# EAGLE design nano_hold_1_2 (EAGLE 7.5.0)
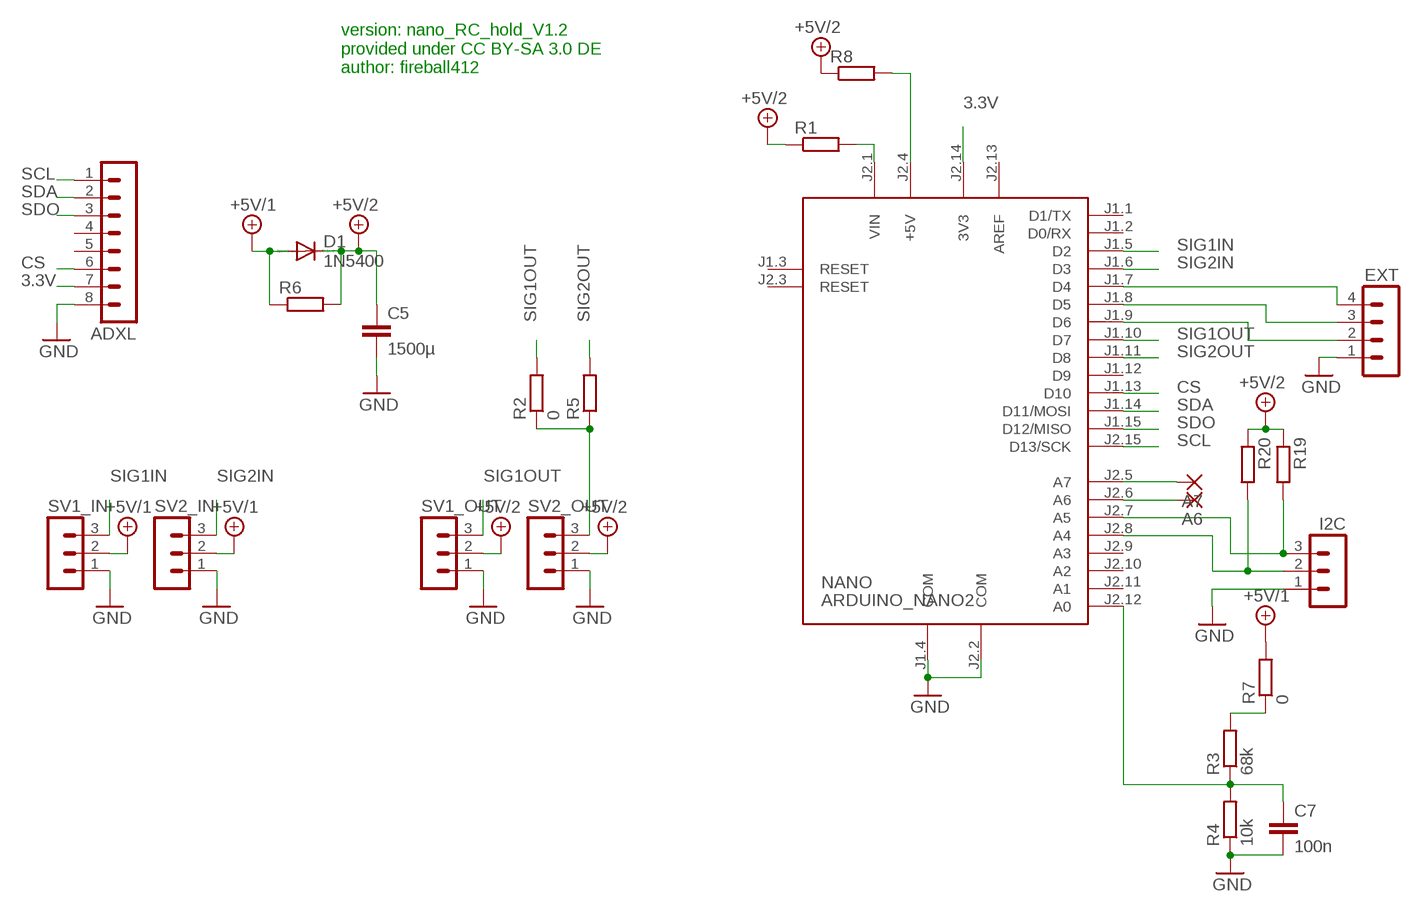
[diagram p0: schematic, sheet 1]

## Parts
A6  WIREPAD2,15/1,0  [2,15/1,0]
A7  WIREPAD2,15/1,0  [2,15/1,0]
ADXL  MA08-1  [MA08-1]
C5  1500µ  C-EU050H075X075  [C050H075X075]
C7  100n  C-EUC0805  [C0805]
D1  1N5400  [DO201-15]
EXT  MA04-1  [MA04-1]
I2C  MA03-1  [MA03-1]
NANO  ARDUINO_NANO2  [ARDUINO_NANO2]
R1  R-EU_R0805  [R0805]
R2  0  R-EU_R0805  [R0805]
R3  68k  R-EU_R0805  [R0805]
R4  10k  R-EU_R0805  [R0805]
R5  R-EU_R0805  [R0805]
R6  R-EU_R0805  [R0805]
R7  0  R-EU_R0805  [R0805]
R8  R-EU_R0805  [R0805]
R19  R-EU_R0805  [R0805]
R20  R-EU_R0805  [R0805]
SV1_IN  MA03-1  [MA03-1]
SV1_OUT  MA03-1  [MA03-1]
SV2_IN  MA03-1  [MA03-1]
SV2_OUT  MA03-1  [MA03-1]

## Nets
3.3V: ADXL.7 NANO.J2.14(3V3)
+5V/1: D1.A R6.1 R7.2 SV1_IN.2 SV2_IN.2
+5V/2: C5.1 D1.C R1.1 R6.2 R8.1 R19.1 R20.1 SV1_OUT.2 SV2_OUT.2
CS: ADXL.6 NANO.J1.13(D10)
GND: ADXL.8 C5.2 C7.2 EXT.1 I2C.1 NANO.J1.4(COM) NANO.J2.2(COM) R4.1 SV1_IN.1 SV1_OUT.1 SV2_IN.1 SV2_OUT.1
N$1: NANO.J2.1(VIN) R1.2
N$2: C7.1 NANO.J2.12(A0) R3.1 R4.2
N$3: R2.1 R5.1 SV2_OUT.3
N$4: EXT.4 NANO.J1.7(D4)
N$5: EXT.3 NANO.J1.8(D5)
N$6: NANO.J2.4(+5V) R8.2
N$7: EXT.2 NANO.J1.9(D6)
N$8: R3.2 R7.1
N$11: A7.1(P) NANO.J2.5(A7)
N$12: A6.1(P) NANO.J2.6(A6)
N$13: I2C.3 NANO.J2.7(A5) R19.2
N$15: I2C.2 NANO.J2.8(A4) R20.2
SCL: ADXL.1 NANO.J2.15(D13/SCK)
SDA: ADXL.2 NANO.J1.14(D11/MOSI)
SDO: ADXL.3 NANO.J1.15(D12/MISO)
SIG1IN: NANO.J1.5(D2) SV1_IN.3
SIG1OUT: NANO.J1.10(D7) R2.2 SV1_OUT.3
SIG2IN: NANO.J1.6(D3) SV2_IN.3
SIG2OUT: NANO.J1.11(D8) R5.2
Unconnected: ADXL.4 ADXL.5 NANO.J1.1(D1/TX) NANO.J1.2(D0/RX) NANO.J1.3(RESET) NANO.J1.12(D9) NANO.J2.3(RESET) NANO.J2.9(A3) NANO.J2.10(A2) NANO.J2.11(A1)

## Notes on the sheet
- version: nano_RC_hold_V1.2
  provided under CC BY-SA 3.0 DE
  author: fireball412

## Power pins joined to a net without a drawn wire
AREF: NANO.J2.13(AREF)

## Library data of the parts
A6 A7 = wirepad:WIREPAD: Wire PAD connect wire on PCB
ADXL = con-lstb:MA08-1: PIN HEADER; OC_FARNELL: unknown; OC_NEWARK: unknown
C5 C7 = rcl:C-EU: CAPACITOR, European symbol
D1 = diode:1N5400: DIODE standard rectifier, 3 A, 50 V (Motorola)
EXT = con-lstb:MA04-1: PIN HEADER; OC_FARNELL: unknown; OC_NEWARK: unknown
I2C SV1_IN SV1_OUT SV2_IN SV2_OUT = con-lstb:MA03-1: PIN HEADER; OC_FARNELL: unknown; OC_NEWARK: unknown
NANO = arduino:ARDUINO_NANO2: Arduino Nano2 Auto generated by modulcreator.ulp \;; ANZAHL: 2; MODUL: TRUE; STECKX0: -76200; STECKX1: 76200; STECKY0: 177800; STECKY1: 177800
R1-R8 R19 R20 = rcl:R-EU_: RESISTOR, European symbol

## Board
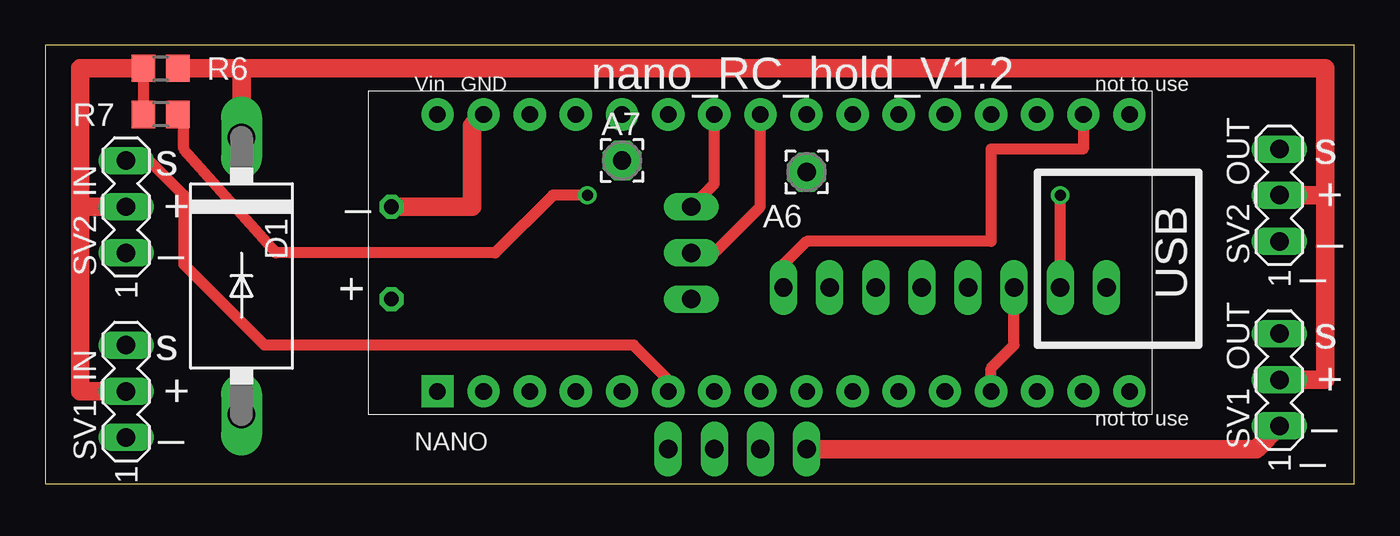
[diagram p1: board, top side]
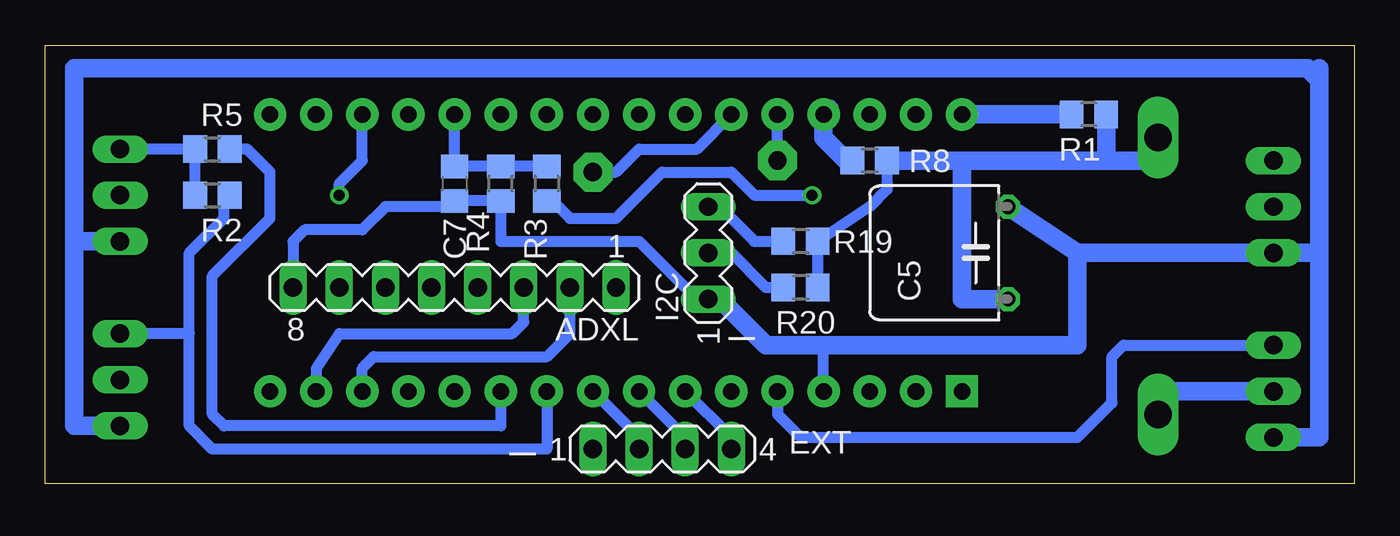
[diagram p2: board, bottom side, seen from below]

Size 72.06 x 24.12 mm. Coordinates in mm from the lower left corner, seen from the top.
Outline: 0,0 72.06,0 72.06,24.12 0,24.12 0,0
Copper layers (1*16): Top 0.035mm / dielectric 1.5mm / Bottom 0.035mm
Design rules "default *": minimum track width 10mil, minimum drill 20mil, track to track 10mil, track to pad 10mil, pad to pad 10mil, via to via 10mil, smd to smd 8mil, copper to edge 20mil, drill to drill 8mil, minimum pad ring 10mil, minimum via ring 8mil, stop-mask expansion 4mil, vias tented up to drill 0mil, thermal gap 10mil

### Footprints (pad centres in the part's own frame; a part is rotated, then mirrored left to right if it is on the bottom)
2,15/1,0 = drill 1.016 pad 2.159 octagon: 1 0,0
MA08-1 = drill 1.016 long: 1 -8.89,0; 2 -6.35,0; 3 -3.81,0; 4 -1.27,0; 5 1.27,0; 6 3.81,0; 7 6.35,0; 8 8.89,0
C050H075X075 = drill 0.813 octagon: 1 -2.54,0; 2 2.54,0
C0805 = smd 1.3 x 1.5: 1 -0.95,0; 2 0.95,0
DO201-15 = drill 1.499 long: A 7.62,0; C -7.62,0
MA04-1 = drill 1.016 long: 1 -3.81,0; 2 -1.27,0; 3 1.27,0; 4 3.81,0
MA03-1 = drill 1.016 long: 1 -2.54,0; 2 0,0; 3 2.54,0
ARDUINO_NANO2 = drill 0.914 pad 1.778 square: J1.1 -7.62,17.78 | drill 0.914 pad 1.778: J1.2 -7.62,15.24; J1.3 -7.62,12.7; J1.4 -7.62,10.16; J1.5 -7.62,7.62; J1.6 -7.62,5.08; J1.7 -7.62,2.54; J1.8 -7.62,0; J1.9 -7.62,-2.54; J1.10 -7.62,-5.08; J1.11 -7.62,-7.62; J1.12 -7.62,-10.16; J1.13 -7.62,-12.7; J1.14 -7.62,-15.24; J1.15 -7.62,-17.78; J2.1 7.62,17.78; J2.2 7.62,15.24; J2.3 7.62,12.7; J2.4 7.62,10.16; J2.5 7.62,7.62; J2.6 7.62,5.08; J2.7 7.62,2.54; J2.8 7.62,0; J2.9 7.62,-2.54; J2.10 7.62,-5.08; J2.11 7.62,-7.62; J2.12 7.62,-10.16; J2.13 7.62,-12.7; J2.14 7.62,-15.24; J2.15 7.62,-17.78
R0805 = smd 1.3 x 1.5: 1 -0.95,0; 2 0.95,0

### Placement (x,y rotation side)
A6  41.91,17.14 0 top
A7  31.75,17.78 0 top
ADXL  49.53,10.79 180 bottom
C5  19.05,12.7 90 bottom
C7  49.53,16.51 270 bottom
D1  10.79,11.43 270 top
EXT  38.1,1.91 0 bottom
I2C  35.56,12.7 90 bottom
NANO  39.37,12.7 90 top
R1  14.61,20.32 180 bottom
R2  62.87,15.88 0 bottom
R3  44.45,16.51 270 bottom
R4  46.99,16.51 90 bottom
R5  62.87,18.41 0 bottom
R6  6.35,22.86 0 top
R7  6.35,20.32 180 top
R8  26.67,17.78 180 bottom
R19  30.48,13.34 180 bottom
R20  30.48,10.79 180 bottom
SV1_IN  4.45,5.08 90 top
SV1_OUT  67.94,5.71 90 top
SV2_IN  4.45,15.24 90 top
SV2_OUT  67.94,15.88 90 top

### Tracks (layer width: path | path; a pad name or v marks a point on that pad's centre or on a via)
3.3V  (via drill 0.6)
  Top 0.61: ADXL.7 v55.88,15.88
  Bottom 0.61: v55.88,15.88 55.88,16.51 54.61,17.78 NANO.J2.14
+5V/1
  Top 0.61: R7.2 R6.1
  Top 1.016: SV1_IN.2 1.91,5.08 1.91,15.24 | 1.91,15.24 SV2_IN.2 | R6.1 1.91,22.86 1.91,15.24
  Bottom 1.016: SV1_IN.2 10.79,5.08 D1.A
+5V/2
  Top 1.016: SV1_OUT.2 70.48,5.71 70.48,15.88 | SV2_OUT.2 70.48,15.88 | 70.48,15.88 70.48,22.86 10.79,22.86 | D1.C 10.79,22.86 | R6.2 10.79,22.86
  Bottom 0.61: R20.1 R19.1 26.67,15.24 25.72,16.19 R8.1
  Bottom 1.016: D1.C 10.79,17.78 13.97,17.78 | 13.97,17.78 21.59,17.78 | 21.59,17.78 21.59,10.16 C5.1 | 21.59,17.78 R8.1 | R1.1 13.65,18.1 13.97,17.78
CS
  Top 0.61: NANO.J1.13 52.07,6.35 53.34,7.62 ADXL.6
GND
  Top 1.016: C5.2 23.5,15.24 23.5,19.68 NANO.J2.2 | EXT.1 66.67,1.91 SV1_OUT.1
  Bottom 0.61: NANO.J1.4 29.21,7.62 | I2C.1 36.2,10.16 39.37,13.34 46.99,13.34 R4.1 C7.2 49.85,15.24 53.34,15.24 54.61,13.97 57.78,13.97 58.42,13.34 ADXL.8
  Bottom 1.016: SV1_IN.1 1.91,2.54 1.91,12.7 | 1.91,12.7 SV2_IN.1 15.24,12.7 | 15.24,12.7 C5.2 | SV1_OUT.1 70.48,3.17 70.48,13.34 | SV2_OUT.1 70.48,13.34 | 70.48,13.34 70.48,22.86 2.54,22.86 1.91,22.23 | 1.91,22.86 1.91,22.23 | 1.91,22.23 1.91,12.7 | I2C.1 34.92,10.16 32.38,7.62 29.21,7.62 15.24,7.62 15.24,12.7
N$1
  Bottom 1.016: R1.2 NANO.J2.1
N$2
  Bottom 0.61: R3.1 R4.2 C7.1 NANO.J2.12
N$3
  Bottom 0.61: R2.1 R5.1 SV2_OUT.3
N$4
  Bottom 0.61: EXT.4 34.29,2.54 NANO.J1.7
N$5
  Bottom 0.61: EXT.3 36.83,2.54 NANO.J1.8
N$6
  Bottom 1.016: 28.89,20.64 NANO.J2.4 29.21,19.05 27.94,17.78 R8.2
N$7
  Bottom 0.61: EXT.2 39.37,2.54 NANO.J1.9
N$8  (via drill 0.6)
  Top 0.61: v29.84,15.88 27.94,15.88 24.77,12.7 12.7,12.7 7.62,18.41 7.62,20 R7.1
  Bottom 0.61: R3.2 44.13,15.56 43.18,14.61 40.64,14.61 38.1,17.14 34.29,17.14 33.02,15.88 v29.84,15.88
N$9  (via drill 0.9 pad 1.78)
  other vias: 59.69,20.32 59.69,5.08
N$11
  Bottom 0.61: A7.1 NANO.J2.5
N$12
  Bottom 0.61: A6.1 40.64,17.14 39.37,18.41 36.2,18.41 NANO.J2.6
N$13
  Top 0.61: I2C.3 36.83,16.51 NANO.J2.7
  Bottom 0.61: I2C.3 34.92,15.24 33.02,13.34 R19.2
N$15
  Top 0.61: I2C.2 36.83,12.7 39.37,15.24 NANO.J2.8
  Bottom 0.61: R20.2 32.38,10.79 34.29,12.7 I2C.2 36.2,12.7
SCL
  Top 0.61: NANO.J2.15 57.15,18.41 52.07,18.41 52.07,13.34 41.91,13.34 40.64,12.06 ADXL.1
SDA
  Bottom 0.61: NANO.J1.14 54.61,6.35 53.98,6.99 44.45,6.99 43.18,8.26 ADXL.2
SDO
  Bottom 0.61: NANO.J1.15 57.15,6.35 55.88,8.26 46.35,8.26 45.72,8.89 ADXL.3
SIG1IN
  Bottom 0.61: NANO.J1.5 31.75,3.81 30.48,2.54 15.24,2.54 13.34,4.45 13.34,6.99 12.7,7.62 SV1_IN.3
SIG1OUT
  Bottom 0.61: NANO.J1.10 44.45,1.91 62.87,1.91 64.14,3.17 64.14,8.26 | 64.14,8.26 SV1_OUT.3 | 64.14,8.26 64.14,12.7 62.23,14.61 62.23,15.56 R2.2
SIG2IN
  Top 0.61: NANO.J1.6 34.29,5.71 32.38,7.62 12.06,7.62 7.62,12.06 7.62,15.88 5.71,17.78 SV2_IN.3
SIG2OUT
  Bottom 0.61: NANO.J1.11 46.99,3.17 62.23,3.17 62.87,3.81 62.87,11.43 59.69,14.61 59.69,17.14 60.96,18.41 R5.2

### Text on the board
tNames: nano_RC_hold_V1.2 | Vin | GND | not to use | s | s | _ | + | + | _ | _ | _ | + | USB | s | s | + | + | _ | _ | not to use | _
bNames: _ | _